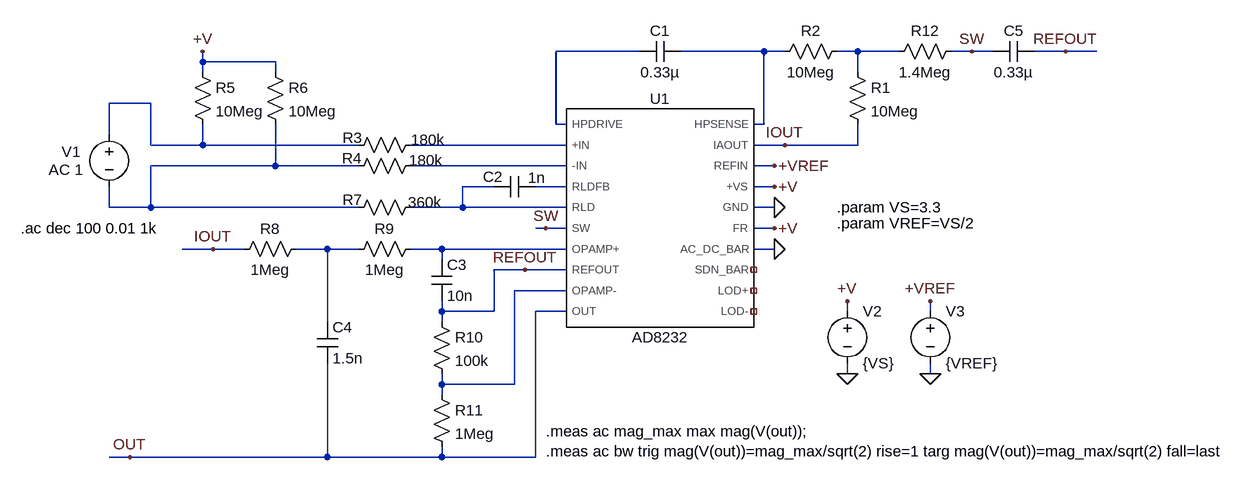
[diagram p0: schematic AD8232_Heart_Rate_Monitor.asc]
AD8232_Heart_Rate_Monitor.asc, the LTspice schematic file:
Version 4.1
SHEET 1 1328 680
WIRE 176 -224 48 -224
WIRE 368 -224 240 -224
WIRE 400 -224 368 -224
WIRE 512 -224 480 -224
WIRE 576 -224 512 -224
WIRE 688 -224 656 -224
WIRE 720 -224 688 -224
WIRE 832 -224 784 -224
WIRE 880 -224 832 -224
WIRE -496 -208 -496 -224
WIRE -384 -208 -496 -208
WIRE -496 -192 -496 -208
WIRE -384 -192 -384 -208
WIRE 512 -192 512 -224
WIRE -576 -144 -640 -144
WIRE 48 -112 48 -224
WIRE 64 -112 48 -112
WIRE 368 -112 368 -224
WIRE 368 -112 352 -112
WIRE -640 -96 -640 -144
WIRE -576 -80 -576 -144
WIRE -496 -80 -496 -112
WIRE -496 -80 -576 -80
WIRE -256 -80 -496 -80
WIRE 64 -80 -176 -80
WIRE 400 -80 352 -80
WIRE 512 -80 512 -112
WIRE 512 -80 400 -80
WIRE -384 -48 -384 -112
WIRE -384 -48 -576 -48
WIRE -256 -48 -384 -48
WIRE 64 -48 -176 -48
WIRE 384 -48 352 -48
WIRE -48 -16 -96 -16
WIRE 64 -16 16 -16
WIRE 384 -16 352 -16
WIRE -640 16 -640 -16
WIRE -576 16 -576 -48
WIRE -576 16 -640 16
WIRE -256 16 -576 16
WIRE -96 16 -96 -16
WIRE -96 16 -176 16
WIRE 64 16 -96 16
WIRE 384 16 352 16
WIRE 32 48 16 48
WIRE 64 48 32 48
WIRE 384 48 352 48
WIRE -480 80 -528 80
WIRE -432 80 -480 80
WIRE -304 80 -352 80
WIRE -256 80 -304 80
WIRE -128 80 -176 80
WIRE 64 80 -128 80
WIRE 384 80 352 80
WIRE -128 96 -128 80
WIRE 0 112 -48 112
WIRE 64 112 0 112
WIRE 64 144 -16 144
WIRE -128 176 -128 160
WIRE -48 176 -48 112
WIRE -48 176 -128 176
WIRE 64 176 16 176
WIRE 496 176 496 160
WIRE 624 176 624 160
WIRE -304 192 -304 80
WIRE -128 192 -128 176
WIRE 496 272 496 256
WIRE 624 272 624 256
WIRE -128 288 -128 272
WIRE -16 288 -16 144
WIRE -16 288 -128 288
WIRE -128 304 -128 288
WIRE -608 400 -640 400
WIRE -304 400 -304 256
WIRE -304 400 -608 400
WIRE -128 400 -128 384
WIRE -128 400 -304 400
WIRE 16 400 16 176
WIRE 16 400 -128 400
FLAG 496 272 0
FLAG 496 160 +V
FLAG 624 272 0
FLAG 624 160 +VREF
FLAG 384 -48 +VREF
FLAG 384 -16 +V
FLAG 384 16 0
FLAG 384 48 +V
FLAG 32 48 SW
FLAG -496 -224 +V
FLAG 0 112 REFOUT
FLAG 400 -80 IOUT
FLAG -480 80 IOUT
FLAG -608 400 OUT
FLAG 384 80 0
FLAG 688 -224 SW
FLAG 832 -224 REFOUT
SYMBOL AD8232 208 32 R0
SYMATTR InstName U1
SYMBOL res 496 -208 R0
SYMATTR InstName R1
SYMATTR Value 10Meg
SYMBOL res 496 -240 R90
WINDOW 0 0 56 VBottom 2
WINDOW 3 32 56 VTop 2
SYMATTR InstName R2
SYMATTR Value 10Meg
SYMBOL cap 240 -240 R90
WINDOW 0 0 32 VBottom 2
WINDOW 3 32 32 VTop 2
SYMATTR InstName C1
SYMATTR Value 0.33µ
SYMBOL res -160 -96 R90
WINDOW 0 20 105 VBottom 2
WINDOW 3 -8 -11 VTop 2
SYMATTR InstName R3
SYMATTR Value 180k
SYMBOL res -160 -64 R90
WINDOW 0 20 106 VBottom 2
WINDOW 3 -8 -8 VTop 2
SYMATTR InstName R4
SYMATTR Value 180k
SYMBOL res -512 -208 R0
SYMATTR InstName R5
SYMATTR Value 10Meg
SYMBOL res -400 -208 R0
SYMATTR InstName R6
SYMATTR Value 10Meg
SYMBOL res -160 0 R90
WINDOW 0 20 105 VBottom 2
WINDOW 3 -8 -6 VTop 2
SYMATTR InstName R7
SYMATTR Value 360k
SYMBOL voltage -640 -112 R0
WINDOW 123 -93 70 Left 2
WINDOW 39 0 0 Left 0
WINDOW 0 -73 42 Left 2
WINDOW 3 -93 98 Left 2
SYMATTR Value2 AC 1
SYMATTR InstName V1
SYMATTR Value ""
SYMBOL voltage 496 160 R0
WINDOW 123 0 0 Left 0
WINDOW 39 0 0 Left 0
SYMATTR InstName V2
SYMATTR Value {VS}
SYMBOL voltage 624 160 R0
WINDOW 123 0 0 Left 0
WINDOW 39 0 0 Left 0
SYMATTR InstName V3
SYMATTR Value {VREF}
SYMBOL res -336 64 R90
WINDOW 0 0 56 VBottom 2
WINDOW 3 32 56 VTop 2
SYMATTR InstName R8
SYMATTR Value 1Meg
SYMBOL cap 16 -32 R90
WINDOW 0 16 65 VBottom 2
WINDOW 3 -13 -2 VTop 2
SYMATTR InstName C2
SYMATTR Value 1n
SYMBOL res -160 64 R90
WINDOW 0 0 56 VBottom 2
WINDOW 3 32 56 VTop 2
SYMATTR InstName R9
SYMATTR Value 1Meg
SYMBOL cap -144 96 R0
SYMATTR InstName C3
SYMATTR Value 10n
SYMBOL res -144 176 R0
SYMATTR InstName R10
SYMATTR Value 100k
SYMBOL cap -320 192 R0
SYMATTR InstName C4
SYMATTR Value 1.5n
SYMBOL res -144 288 R0
SYMATTR InstName R11
SYMATTR Value 1Meg
SYMBOL res 672 -240 R90
WINDOW 0 0 56 VBottom 2
WINDOW 3 32 56 VTop 2
SYMATTR InstName R12
SYMATTR Value 1.4Meg
SYMBOL cap 784 -240 R90
WINDOW 0 0 32 VBottom 2
WINDOW 3 32 32 VTop 2
SYMATTR InstName C5
SYMATTR Value 0.33µ
TEXT -776 48 Left 2 !.ac dec 100 0.01 1k
TEXT 480 16 Left 2 !.param VS=3.3
TEXT 480 40 Left 2 !.param VREF=VS/2
TEXT 32 360 Left 2 !.meas ac mag_max max mag(V(out));\n.meas ac bw trig mag(V(out))=mag_max/sqrt(2) rise=1 targ mag(V(out))=mag_max/sqrt(2) fall=last

The netlist it stands for:
* AD8232_Heart_Rate_Monitor.asc
X§U1 N001 N005 N007 N009 N008 SW N011 REFOUT N012 OUT NC_01 NC_02 NC_03 0 +V 0 +V +VREF IOUT N002 AD8232  ; pins HPDRIVE +IN -IN RLDFB RLD SW OPAMP+ REFOUT OPAMP- OUT LOD- LOD+ SDN_BAR AC_DC_BAR FR GND +VS REFIN IAOUT HPSENSE
R1 N003 IOUT 10Meg
R2 N003 N002 10Meg
C1 N002 N001 0.33µ
R3 N005 N004 180k
R4 N007 N006 180k
R5 +V N004 10Meg
R6 +V N006 10Meg
R7 N008 N006 360k
V1 N004 N006 AC 1
V2 +V 0 {VS}
V3 +VREF 0 {VREF}
R8 N010 IOUT 1Meg
C2 N009 N008 1n
R9 N011 N010 1Meg
C3 N011 REFOUT 10n
R10 REFOUT N012 100k
C4 N010 OUT 1.5n
R11 N012 OUT 1Meg
R12 SW N003 1.4Meg
C5 REFOUT SW 0.33µ
.ac dec 100 0.01 1k
.param VS=3.3
.param VREF=VS/2
.meas ac mag_max max mag(V(out));
.meas ac bw trig mag(V(out))=mag_max/sqrt(2) rise=1 targ mag(V(out))=mag_max/sqrt(2) fall=last
.lib AD8232.cir
.backanno
.end